# Altium schematic sheet Slot Pullups and Pulldowns.SchDoc: Modular Parent Motherboard
size Letter; DrawnBy: MTAN; Organization: Altium Limited; DocumentNumber: 3; Revision: B; SheetNumber: 3; SheetTotal: 6
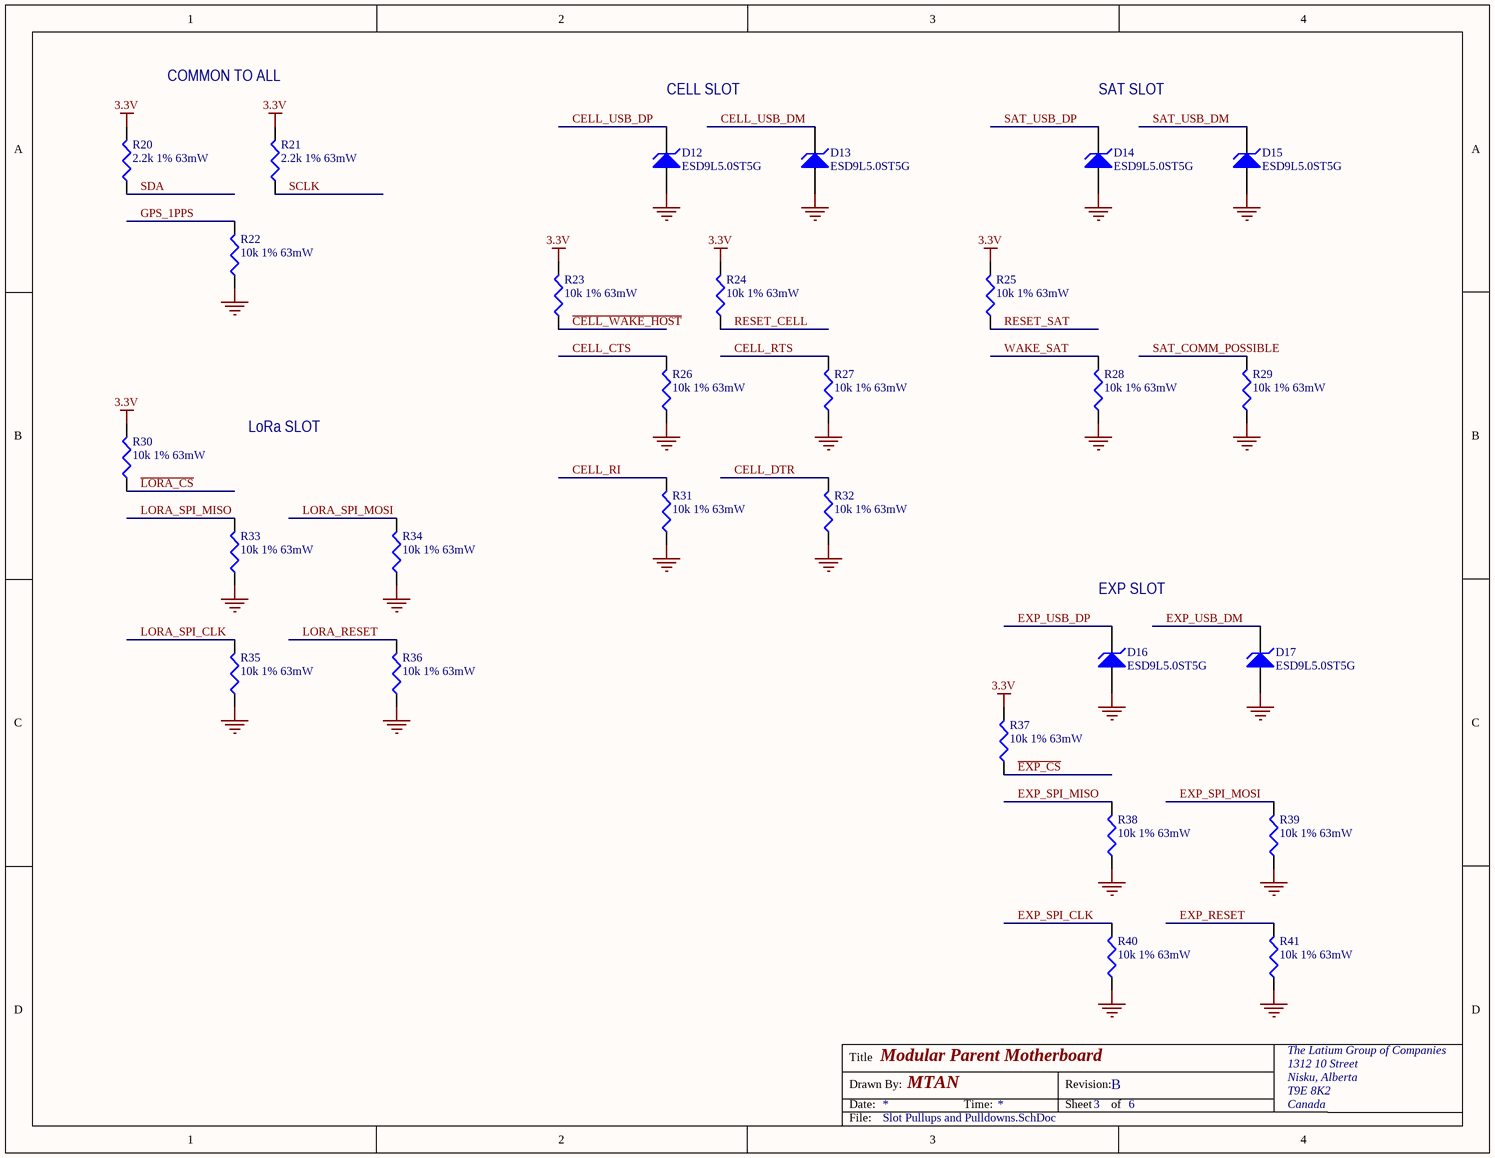
[diagram p0: Slot Pullups and Pulldowns.SchDoc]

## Parts
D12  ESD9L5.0ST5G  [SOD-923]
D13  ESD9L5.0ST5G  [SOD-923]
D14  ESD9L5.0ST5G  [SOD-923]
D15  ESD9L5.0ST5G  [SOD-923]
D16  ESD9L5.0ST5G  [SOD-923]
D17  ESD9L5.0ST5G  [SOD-923]
R20  2.2k 1% 63mW  [RESC1005L]
R21  2.2k 1% 63mW  [RESC1005L]
R22  10k 1% 63mW  [RESC1005L]
R23  10k 1% 63mW  [RESC1005L]
R24  10k 1% 63mW  [RESC1005L]
R25  10k 1% 63mW  [RESC1005L]
R26  10k 1% 63mW  [RESC1005L]
R27  10k 1% 63mW  [RESC1005L]
R28  10k 1% 63mW  [RESC1005L]
R29  10k 1% 63mW  [RESC1005L]
R30  10k 1% 63mW  [RESC1005L]
R31  10k 1% 63mW  [RESC1005L]
R32  10k 1% 63mW  [RESC1005L]
R33  10k 1% 63mW  [RESC1005L]
R34  10k 1% 63mW  [RESC1005L]
R35  10k 1% 63mW  [RESC1005L]
R36  10k 1% 63mW  [RESC1005L]
R37  10k 1% 63mW  [RESC1005L]
R38  10k 1% 63mW  [RESC1005L]
R39  10k 1% 63mW  [RESC1005L]
R40  10k 1% 63mW  [RESC1005L]
R41  10k 1% 63mW  [RESC1005L]

## Nets
3.3V: R20.2 R21.2 R23.2 R24.2 R25.2 R30.2 R37.2
GND: D12.1(A) D13.1(A) D14.1(A) D15.1(A) D16.1(A) D17.1(A) R22.1 R26.1 R27.1 R28.1 R29.1 R31.1 R32.1 R33.1 R34.1 R35.1 R36.1 R38.1 R39.1 R40.1 R41.1
~{CELL_WAKE_HOST}: R23.1
CELL_CTS: R26.2
CELL_DTR: R32.2
CELL_RI: R31.2
CELL_RTS: R27.2
CELL_USB_DM: D13.2(K)
CELL_USB_DP: D12.2(K)
~{EXP_CS}: R37.1
EXP_RESET: R41.2
EXP_SPI_CLK: R40.2
EXP_SPI_MISO: R38.2
EXP_SPI_MOSI: R39.2
EXP_USB_DM: D17.2(K)
EXP_USB_DP: D16.2(K)
GPS_1PPS: R22.2
~{LORA_CS}: R30.1
LORA_RESET: R36.2
LORA_SPI_CLK: R35.2
LORA_SPI_MISO: R33.2
LORA_SPI_MOSI: R34.2
RESET_CELL: R24.1
RESET_SAT: R25.1
SAT_COMM_POSSIBLE: R29.2
SAT_USB_DM: D15.2(K)
SAT_USB_DP: D14.2(K)
SCLK: R21.1
SDA: R20.1
WAKE_SAT: R28.2

## Notes on the sheet
- COMMON TO ALL
- CELL SLOT
- SAT SLOT
- LoRa SLOT
- EXP SLOT
- Title
- Drawn By:
- Date:
- Time:
- Revision:
- Sheet
- of
- The Latium Group of Companies
- 1312 10 Street
- Nisku, Alberta
- T9E 8K2
- Canada
- File:

## Library data of the parts
D12-D17 = D Zener: TVS DIODE 5V 9.8V SOD923; Manufacturer: ON Semiconductor; Value: ESD9L5.0ST5G; Manufacturer Part Number: ESD9L5.0ST5G; Supplier 1: Digi-Key; Supplier 1 Part Number: ESD9L5.0ST5GOSCT-ND
R20-R41 = Res3: Resistor
  R20 R21: Value: 2.2k 1% 63mW
  R22-R41: Value: 10k 1% 63mW